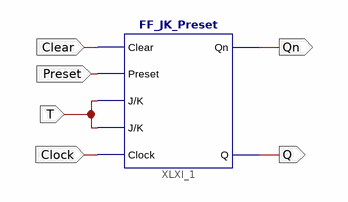
[diagram p0: schematic sheet 1]
// Xilinx ISE schematic FF_T_Preset.sch (spartan3e) as structural Verilog: 1 symbols, 6 ports
module FF_T_Preset (
  input  T,
  input  Clock,
  input  Preset,
  input  Clear,
  output Q,
  output Qn
);

  FF_JK_Preset XLXI_1 (.Clear(Clear), .Preset(Preset), .J(T), .K(T), .Clock(Clock), .Qn(Qn), .Q(Q));
endmodule
